# EAGLE design 12V to 6V isolated (LM3478) (EAGLE 6.5.0)
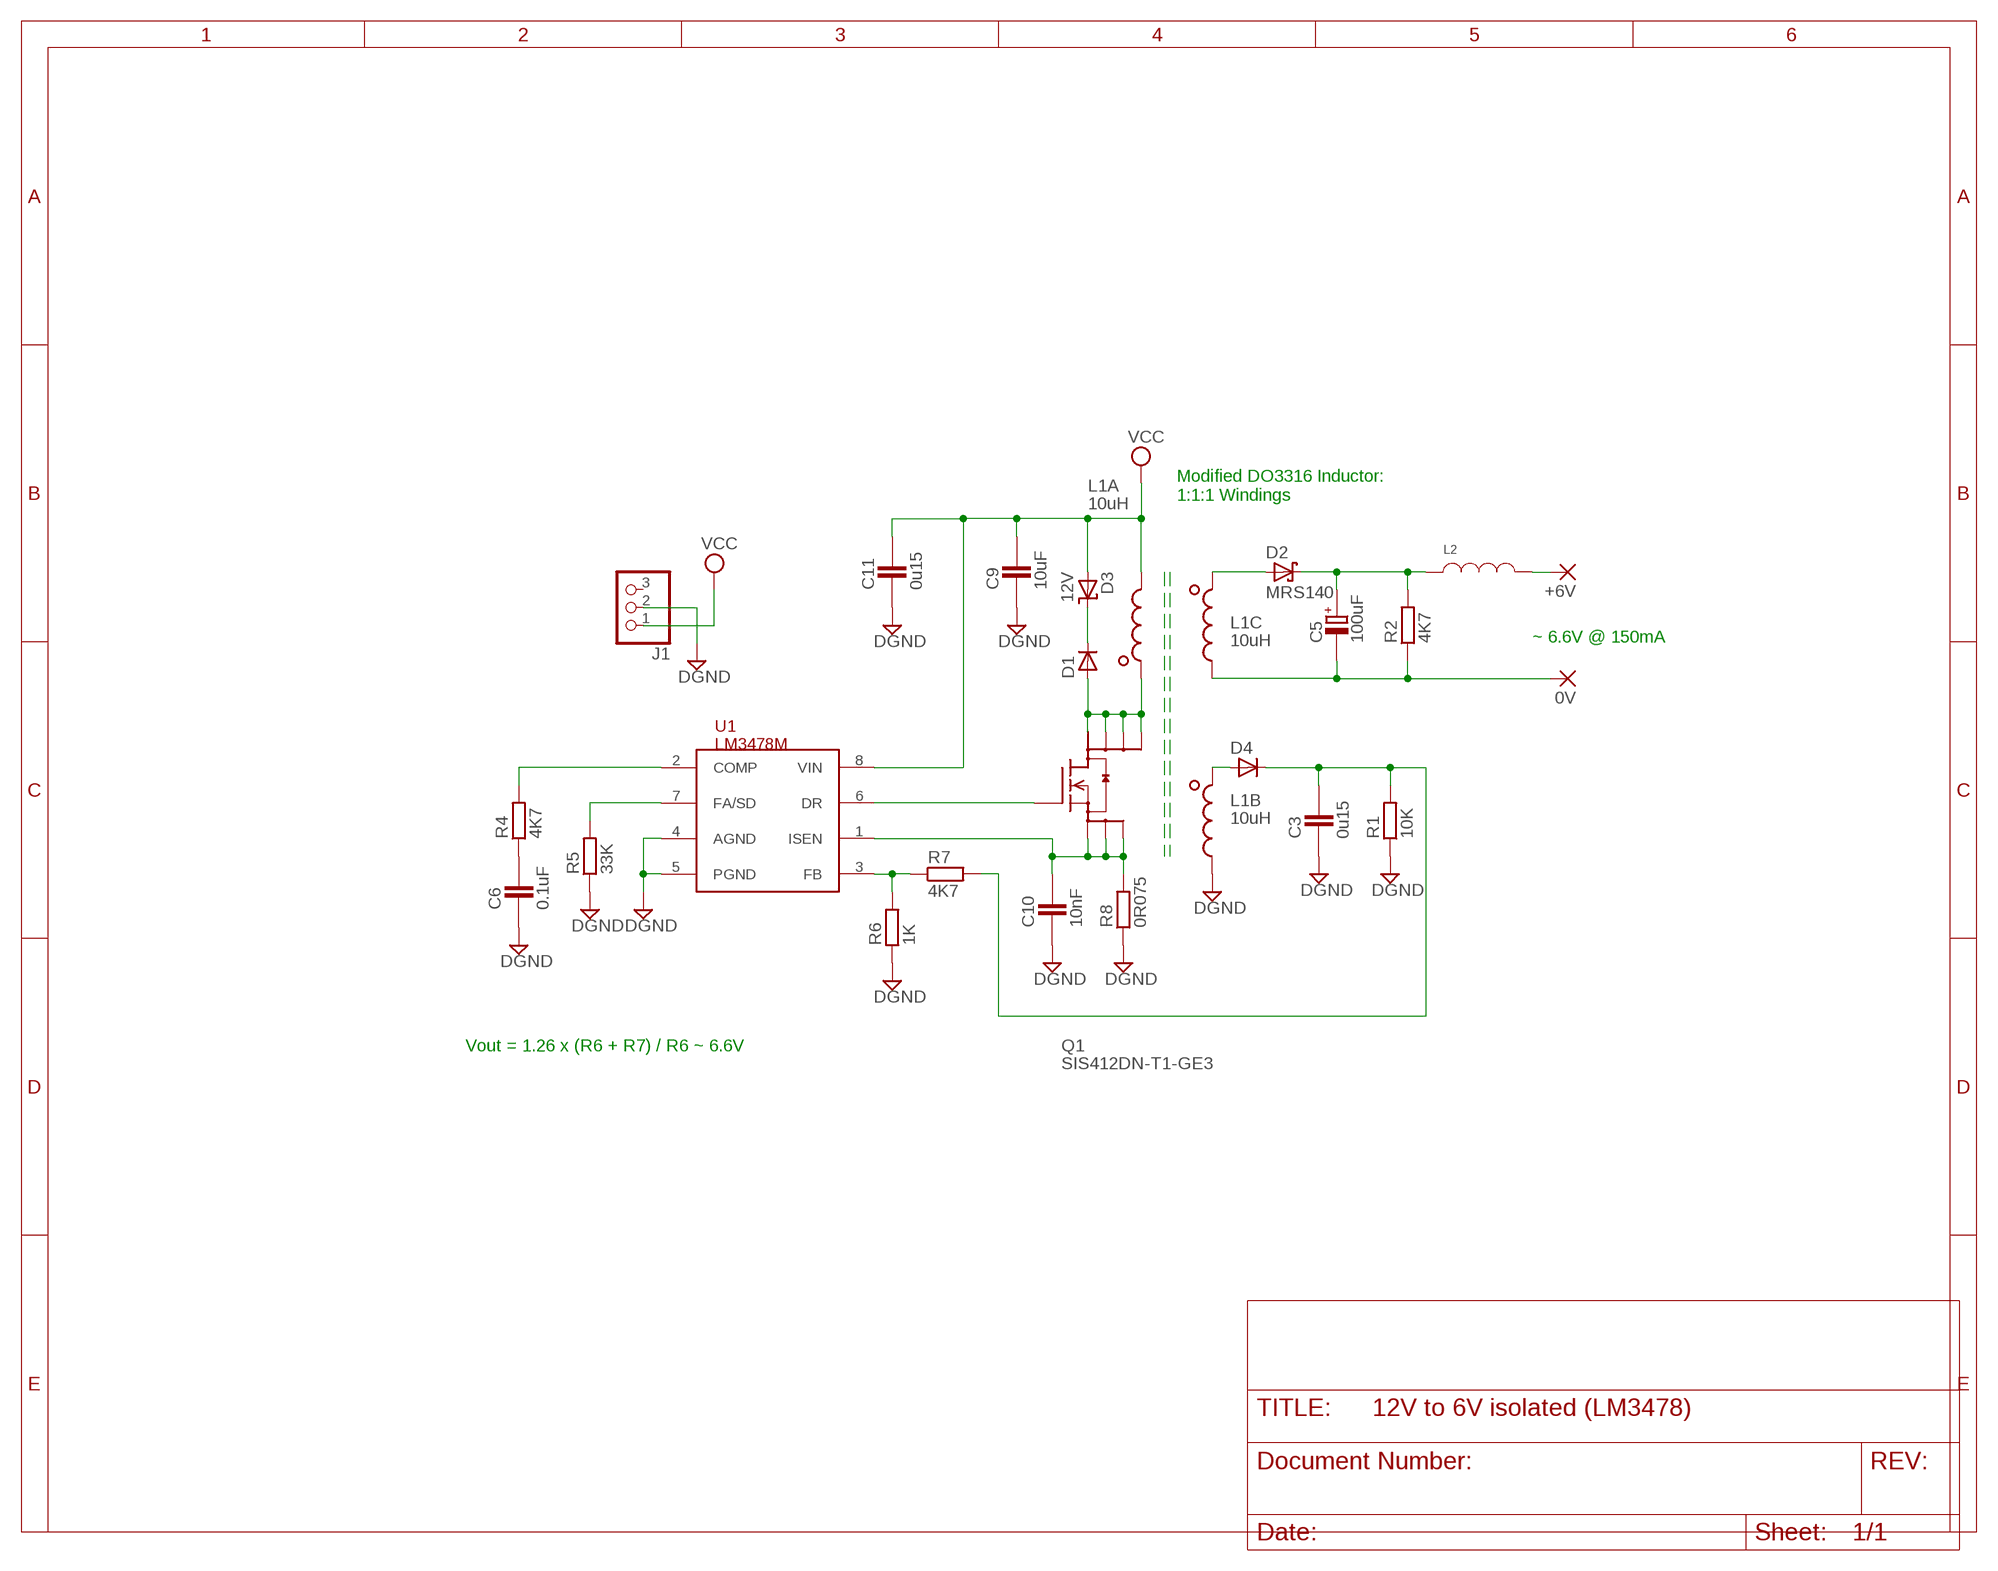
[diagram p0: schematic, sheet 1]

## Parts
0V  SMD2  [SMD1,27-2,54]
+6V  SMD2  [SMD1,27-2,54]
C3  0u15  CAPACITOR_0805N  [CAP2012X70N]
C5  100uF  POLARISED_D_CASE  [CAPMP7343X310N]
C6  0.1uF  CAPACITOR_0603  [CAPC1608X92N]
C9  10uF  CAPACITOR_1210  [CAPC3225X168N]
C10  10nF  CAPACITOR_0603  [CAPC1608X92N]
C11  0u15  CAPACITOR_0805N  [CAP2012X70N]
D1  DIODE_SOT-23  [SOT95P280X135-3N]
D2  MRS140  SCHOTTKY_SMB  [DIOM5436X265N]
D3  12V  ZENER_SOT-23  [SOT95P280X135-3N]
D4  DIODE_SOT-23  [SOT95P280X135-3N]
J1  PINHD-1X3  [1X03]
L1  10uH  DO3316P-3  [DO3316P-3]
L2  INDUCTOR_1812  [INDC4532X175N]
Q1  SIS412DN-T1-GE3  MOSFET-NCH_8_1212  [POWER-PAK1212]
R1  10K  RESISTOR_0805  [RESC2012X70N]
R2  4K7  RESISTOR_0805  [RESC2012X70N]
R4  4K7  RESISTOR_0603  [RESC1608X55N]
R5  33K  RESISTOR_0603  [RESC1608X55N]
R6  1K  RESISTOR_0805  [RESC2012X70N]
R7  4K7  RESISTOR_0805  [RESC2012X70N]
R8  0R075  RESISTOR_2512  [RESC6432X70N]
U1  LM3478M  [MSOP8]

## Nets
DGND: C3.1 C6.1 C9.1 C10.1 C11.1 J1.2 L1.4 R1.1 R5.1 R6.1 R8.1 U1.4(AGND) U1.5(PGND)
N$1: R4.2 U1.2(COMP)
N$2: D1.3(K) D3.3(K)
N$3: C6.2 R4.1
N$4: R5.2 U1.7(FA/SD)
N$5: D4.1(A) L1.3
N$6: Q1.4(G) U1.6(DR)
N$7: C3.2 D4.3(K) R1.2 R7.2
N$8: C5.+ D2.K L2.1 R2.2
N$9: R6.2 R7.1 U1.3(FB)
N$10: 0V.1(P) C5.- L1.6 R2.1
N$12: D1.1(A) L1.1 Q1.5(D1) Q1.6(D2) Q1.7(D3) Q1.8(D4)
N$13: D2.A L1.5
N$14: +6V.1(P) L2.2
N$31: C10.2 Q1.1(S1) Q1.2(S2) Q1.3(S3) R8.2 U1.1(ISEN)
VCC: C9.2 C11.2 D3.1(A) J1.1 L1.2 U1.8(VIN)
Unconnected: J1.3

## Notes on the sheet
- Modified DO3316 Inductor:
  1:1:1 Windings
- ~ 6.6V @ 150mA
- Vout = 1.26 x (R6 + R7) / R6 ~ 6.6V

## Library data of the parts
0V +6V = wirepad:SMD2: SMD PAD
C3 C6 C9-C11 = ipc-7351-capacitor:CAPACITOR_
C5 = ipc-7351-capacitor:POLARISED_
D1 D4 = ipc-7351-diode:DIODE_
D2 = ipc-7351-diode:SCHOTTKY_
D3 = ipc-7351-diode:ZENER_
J1 = Misc Conn:PINHD-1X3: PIN HEADER
L1 = Misc Inductors:DO3316P-3: COILCRAFT
L2 = ipc-7351-inductor:INDUCTOR_
Q1 = ipc-7351-transistor:MOSFET-NCH_8_
R1 R2 R4-R8 = ipc-7351-resistor:RESISTOR_
U1 = Misc Power:LM3478: Boost Controller Input: 3V-40V

## Board
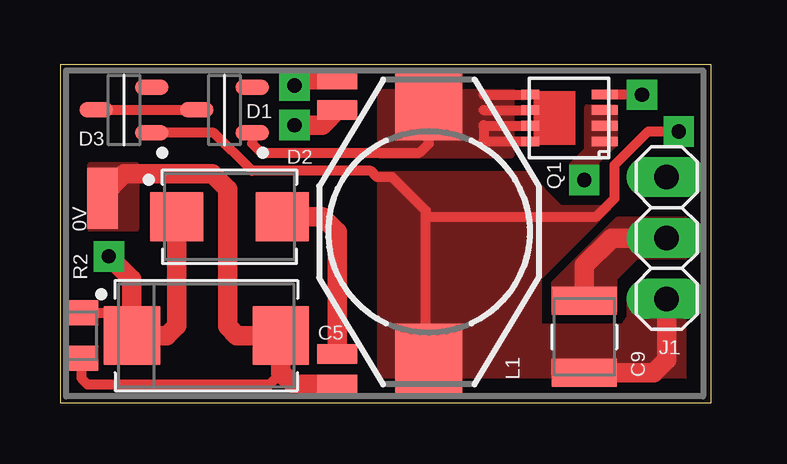
[diagram p1: board, top side]
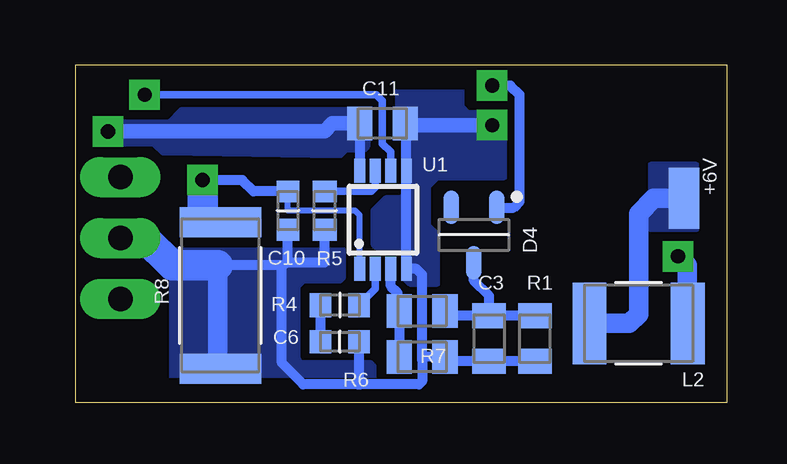
[diagram p2: board, bottom side, seen from below]

Size 27.13 x 14.09 mm. Coordinates in mm from the lower left corner, seen from the top.
Outline: 0,0 27.13,0 27.13,14.09 0,14.09 0,0
Copper layers (1*16): Top 0.035mm / dielectric 1.5mm / Bottom 0.035mm
Design rules "default": minimum track width 10mil, minimum drill 24mil, track to track 8mil, track to pad 8mil, pad to pad 8mil, via to via 8mil, smd to smd 8mil, copper to edge 40mil, drill to drill 8mil, minimum pad ring 10mil, minimum via ring 8mil, stop-mask expansion 4mil, vias tented up to drill 0mil, thermal gap 10mil

### Footprints (pad centres in the part's own frame; a part is rotated, then mirrored left to right if it is on the bottom)
SMD1,27-2,54 = smd 1.27 x 2.54: 1 0,0
CAP2012X70N = smd 1.05 x 1.4: 1 -0.95,0; 2 0.95,0
CAPMP7343X310N = smd 2.35 x 2.45: + -3.1,0; - 3.1,0
CAPC1608X92N = smd 0.9 x 0.95: 1 -0.8,0; 2 0.8,0
CAPC3225X168N = smd 1.15 x 2.7: 1 -1.5,0; 2 1.5,0
SOT95P280X135-3N = smd 1.4 x 0.65: 1 -1.15,0.95; 2 -1.15,-0.95; 3 1.15,0
DIOM5436X265N = smd 2.2 x 2.05: A 2.2,0; K -2.2,0
1X03 = drill 1.016 pad 1.676 long: 1 -2.54,0; 2 0,0; 3 2.54,0
DO3316P-3 = smd 2.92 x 2.79: 1 -5.28,0; 2 5.28,0 | smd 0.813 x 1.676: 3 -6.35,-3.81; 4 -5.08,-3.81; 5 5.08,-3.81; 6 6.35,-3.81
INDC4532X175N = smd 1.4 x 3.4: 1 -2.05,0; 2 2.05,0
POWER-PAK1212 = smd 0.4 x 1.1: 1 -0.975,-1.488; 2 -0.325,-1.488; 3 0.325,-1.488; 4 0.975,-1.488 | smd 0.4 x 0.762: 5 0.975,1.615; 6 0.325,1.615; 7 -0.325,1.615; 8 -0.975,1.615
RESC2012X70N = smd 1.05 x 1.4: 1 -0.95,0; 2 0.95,0
RESC1608X55N = smd 0.9 x 1: 1 -0.8,0; 2 0.8,0
RESC6432X70N = smd 1.25 x 3.4: 1 -3.05,0; 2 3.05,0
MSOP8 = smd 0.45 x 1: 1 -0.975,-2.05; 2 -0.325,-2.05; 3 0.325,-2.05; 4 0.975,-2.05; 5 0.975,2.05; 6 0.325,2.05; 7 -0.325,2.05; 8 -0.975,2.05

### Placement (x,y rotation side)
0V  1.78,8.51 0 top
+6V  1.78,8.51 0 bottom
C3  9.91,2.67 90 bottom
C5  6.1,2.79 0 top
C6  16.13,2.54 180 bottom
C9  21.84,2.74 270 top
C10  18.29,8 90 bottom
C11  14.35,11.63 180 bottom
D1  6.86,12.19 180 top
D2  7.06,7.75 0 top
D3  2.67,12.19 180 top
D4  10.54,6.99 270 bottom
J1  25.27,6.86 90 top
L1  15.37,7.11 270 top
L2  3.68,3.3 180 bottom
Q1  21.21,11.86 90 top
R1  8,2.67 90 bottom
R2  0.89,2.79 90 top
R4  16.13,4.06 0 bottom
R5  16.76,8 90 bottom
R6  12.7,1.91 180 bottom
R7  12.7,3.81 0 bottom
R8  21.11,4.47 90 bottom
U1  14.33,7.62 0 bottom

### Tracks (layer width: path | path; a pad name or v marks a point on that pad's centre or on a via)
DGND  (via drill 0.6 pad 1.27)
  Top 0.813: J1.2 22.99,6.86 21.84,5.71 C9.1 | v9.78,11.56 10.92,11.56 L1.4
  Bottom 0.406: C11.1 13.35,11.71 U1.5 U1.4 12.94,5.57 12.7,5.33 12.7,1.78 | 15.33,0.8 C6.1 | 15.33,0.8 15.37,0.76 17.65,0.76 18.54,1.65 18.54,5.71 | 18.54,5.71 21.21,5.71 | 18.29,5.84 C10.1 | 18.54,5.71 18.29,5.84 | 12.7,1.78 12.7,0.89 12.83,0.76 15.29,0.76 15.33,0.8 | 12.7,1.78 12.57,1.91 R6.1 11.56,1.72 C3.1 R1.1 | R5.1 16.76,5.84 18.29,5.84
  Bottom 0.61: v9.78,11.56 13.32,11.56 C11.1
  Bottom 0.813: 21.21,5.71 21.21,1.52
  Bottom 1.016: 21.21,1.52 R8.1
  Bottom 1.27: J1.2 24.26,6.86 23.11,5.71 21.21,5.71
  pour Top (no thermals): 26.42,7.62 23.24,7.62 20.57,4.95 20.57,3.81 23.11,3.81 23.11,5.21 24,6.1 26.42,6.1 26.8,6.48 26.8,7.24
  pour Bottom (no thermals): 22.86,6.35 16,6.35 16,5.21 16.13,5.08 17.65,5.08 17.91,4.83 17.91,1.91 17.78,1.65 14.86,1.65 14.73,1.52 14.73,0.51 23.11,0.51 23.11,6.1
  pour Bottom (no thermals): 9.27,12.06 10.79,12.06 11.05,12.32 11.05,13.72 11.18,13.84 13.21,13.84 13.72,13.33 13.72,11.3 13.46,11.05 13.46,8.64 13.59,8.51 14.22,8.51 14.73,8 14.73,6.6 14.6,6.48 13.59,6.48 13.46,6.35 13.46,5.21 13.21,4.95 12.06,4.95 12.06,6.99 12.45,7.37 12.45,9.02 12.06,9.4 9.27,9.4
N$1
  Bottom 0.305: U1.2 14.65,4.74 R4.2
N$2
  Top 0.406: D3.3 D1.3
N$3
  Bottom 0.406: C6.2 R4.1
N$4
  Bottom 0.305: R5.2 14.82,8.8 14.65,8.97 U1.7
N$5  (via drill 0.6 pad 1.27)
  Top 0.813: L1.3 10.03,13.46 v9.78,13.21
  Bottom 0.406: v9.78,13.21 9.02,13.21 8.64,12.83 8.64,8.38 8.89,8.13 D4.1
N$6  (via drill 0.6 pad 1.27)
  Top 0.406: Q1.4 24.12,12.84 v24.26,12.83
  Bottom 0.305: U1.6 14,10.44 14.35,10.79 14.35,12.57 14.6,12.83 v24.26,12.83
N$7
  Bottom 0.406: C3.2 11.56,3.62 R7.2 | D4.3 10.54,5.08 9.91,4.45 C3.2 | R1.2 C3.2
N$8  (via drill 0.6 pad 1.27)
  Top 0.406: R2.2 2.81,3.74 3,3.56
  Top 0.813: D2.K 4.86,3.21 4.45,2.79 C5.+ 3,3.56 3,5.13 v2.03,6.1
  Bottom 0.813: L2.1 1.65,5.71 v2.03,6.1
N$9
  Bottom 0.406: U1.3 14,4.86 13.72,4.57 13.72,3.88 R7.1 R6.2
N$10
  Top 0.406: R2.1 0.89,1.02 1.14,0.76 8.74,0.76 9.2,1.22
  Top 0.813: L1.6 9.78,0.76 9.2,1.22 C5.- 7.37,2.79 6.99,3.17 6.99,8.89 6.35,9.52 2.67,9.52 2.16,9.02 2.03,9.02
  pour Top (no thermals): 1.27,9.91 3.17,9.91 3.17,7.24 1.27,7.24
N$12
  Top 0.406: D1.1 8.01,10.79 8.38,10.41 14.99,10.41 15.37,10.79 L1.1 | 17.65,12.19 17.66,12.19 Q1.6 | 17.67,11.54 17.65,11.56 | Q1.8 17.69,10.89 17.65,10.92 17.65,11.52 17.67,11.54 | 17.67,11.54 Q1.7 | Q1.5 17.66,12.84 17.65,12.83
  pour Top (no thermals): 18.8,13.72 18.8,10.29 13.33,10.29 13.33,13.72
N$13
  Top 0.813: D2.A 10.92,7.75 11.56,7.11 L1.5
N$14
  Bottom 0.813: L2.2 4.06,3.3 3.68,3.68 3.68,7.87 3.05,8.51 +6V.1
  pour Bottom (no thermals): 1.27,7.24 1.27,9.91 3.17,9.91 3.17,7.24
N$31  (via drill 0.6 pad 1.27)
  Bottom 0.254: U1.1 15.3,7.81 15.49,8 18.29,8 C10.2
  Bottom 0.406: R8.2 21.11,7.47 21.84,7.75 | C10.2 19.72,8.8 20.19,9.27 v21.84,9.27
  Bottom 1.27: v21.84,9.27 21.84,7.75
  pour Top (no thermals): 21.97,12.32 23.11,12.32 23.11,10.79 22.35,10.03 22.35,8.76 21.34,8.76 21.34,9.91 21.97,10.54
VCC  (via drill 0.6 pad 1.27)
  Top 0.406: D3.1 6.41,11.24 8,9.65 12.95,9.65 13.21,9.4 13.84,9.4 15.24,8 15.24,7.62 | 15.24,7.62 15.24,1.96 L1.2 | v25.78,11.3 24.51,11.3 23.11,9.91 23.11,8.51 22.35,7.75 15.37,7.75 15.24,7.62
  Top 0.813: C9.2 24.74,1.24 25.27,1.78 J1.1
  Bottom 0.406: U1.8 15.3,11.25 C11.2
  Bottom 0.61: C11.2 16.43,11.63 16.76,11.3 v25.78,11.3
  pour Top (no thermals): 13.33,9.52 19.43,9.52 20.83,8.13 22.86,8.13 19.94,5.21 19.94,3.17 23.5,3.17 23.75,3.56 23.75,4.45 24.26,4.95 26.42,4.95 26.8,4.57 26.8,0.51 13.33,0.51
  pour Bottom (no thermals): 26.04,11.68 23.24,11.68 22.73,12.19 14.99,12.19 14.99,10.67 15.11,10.54 15.87,10.54 16.13,10.29 23.5,10.41 23.88,10.79 26.04,10.79